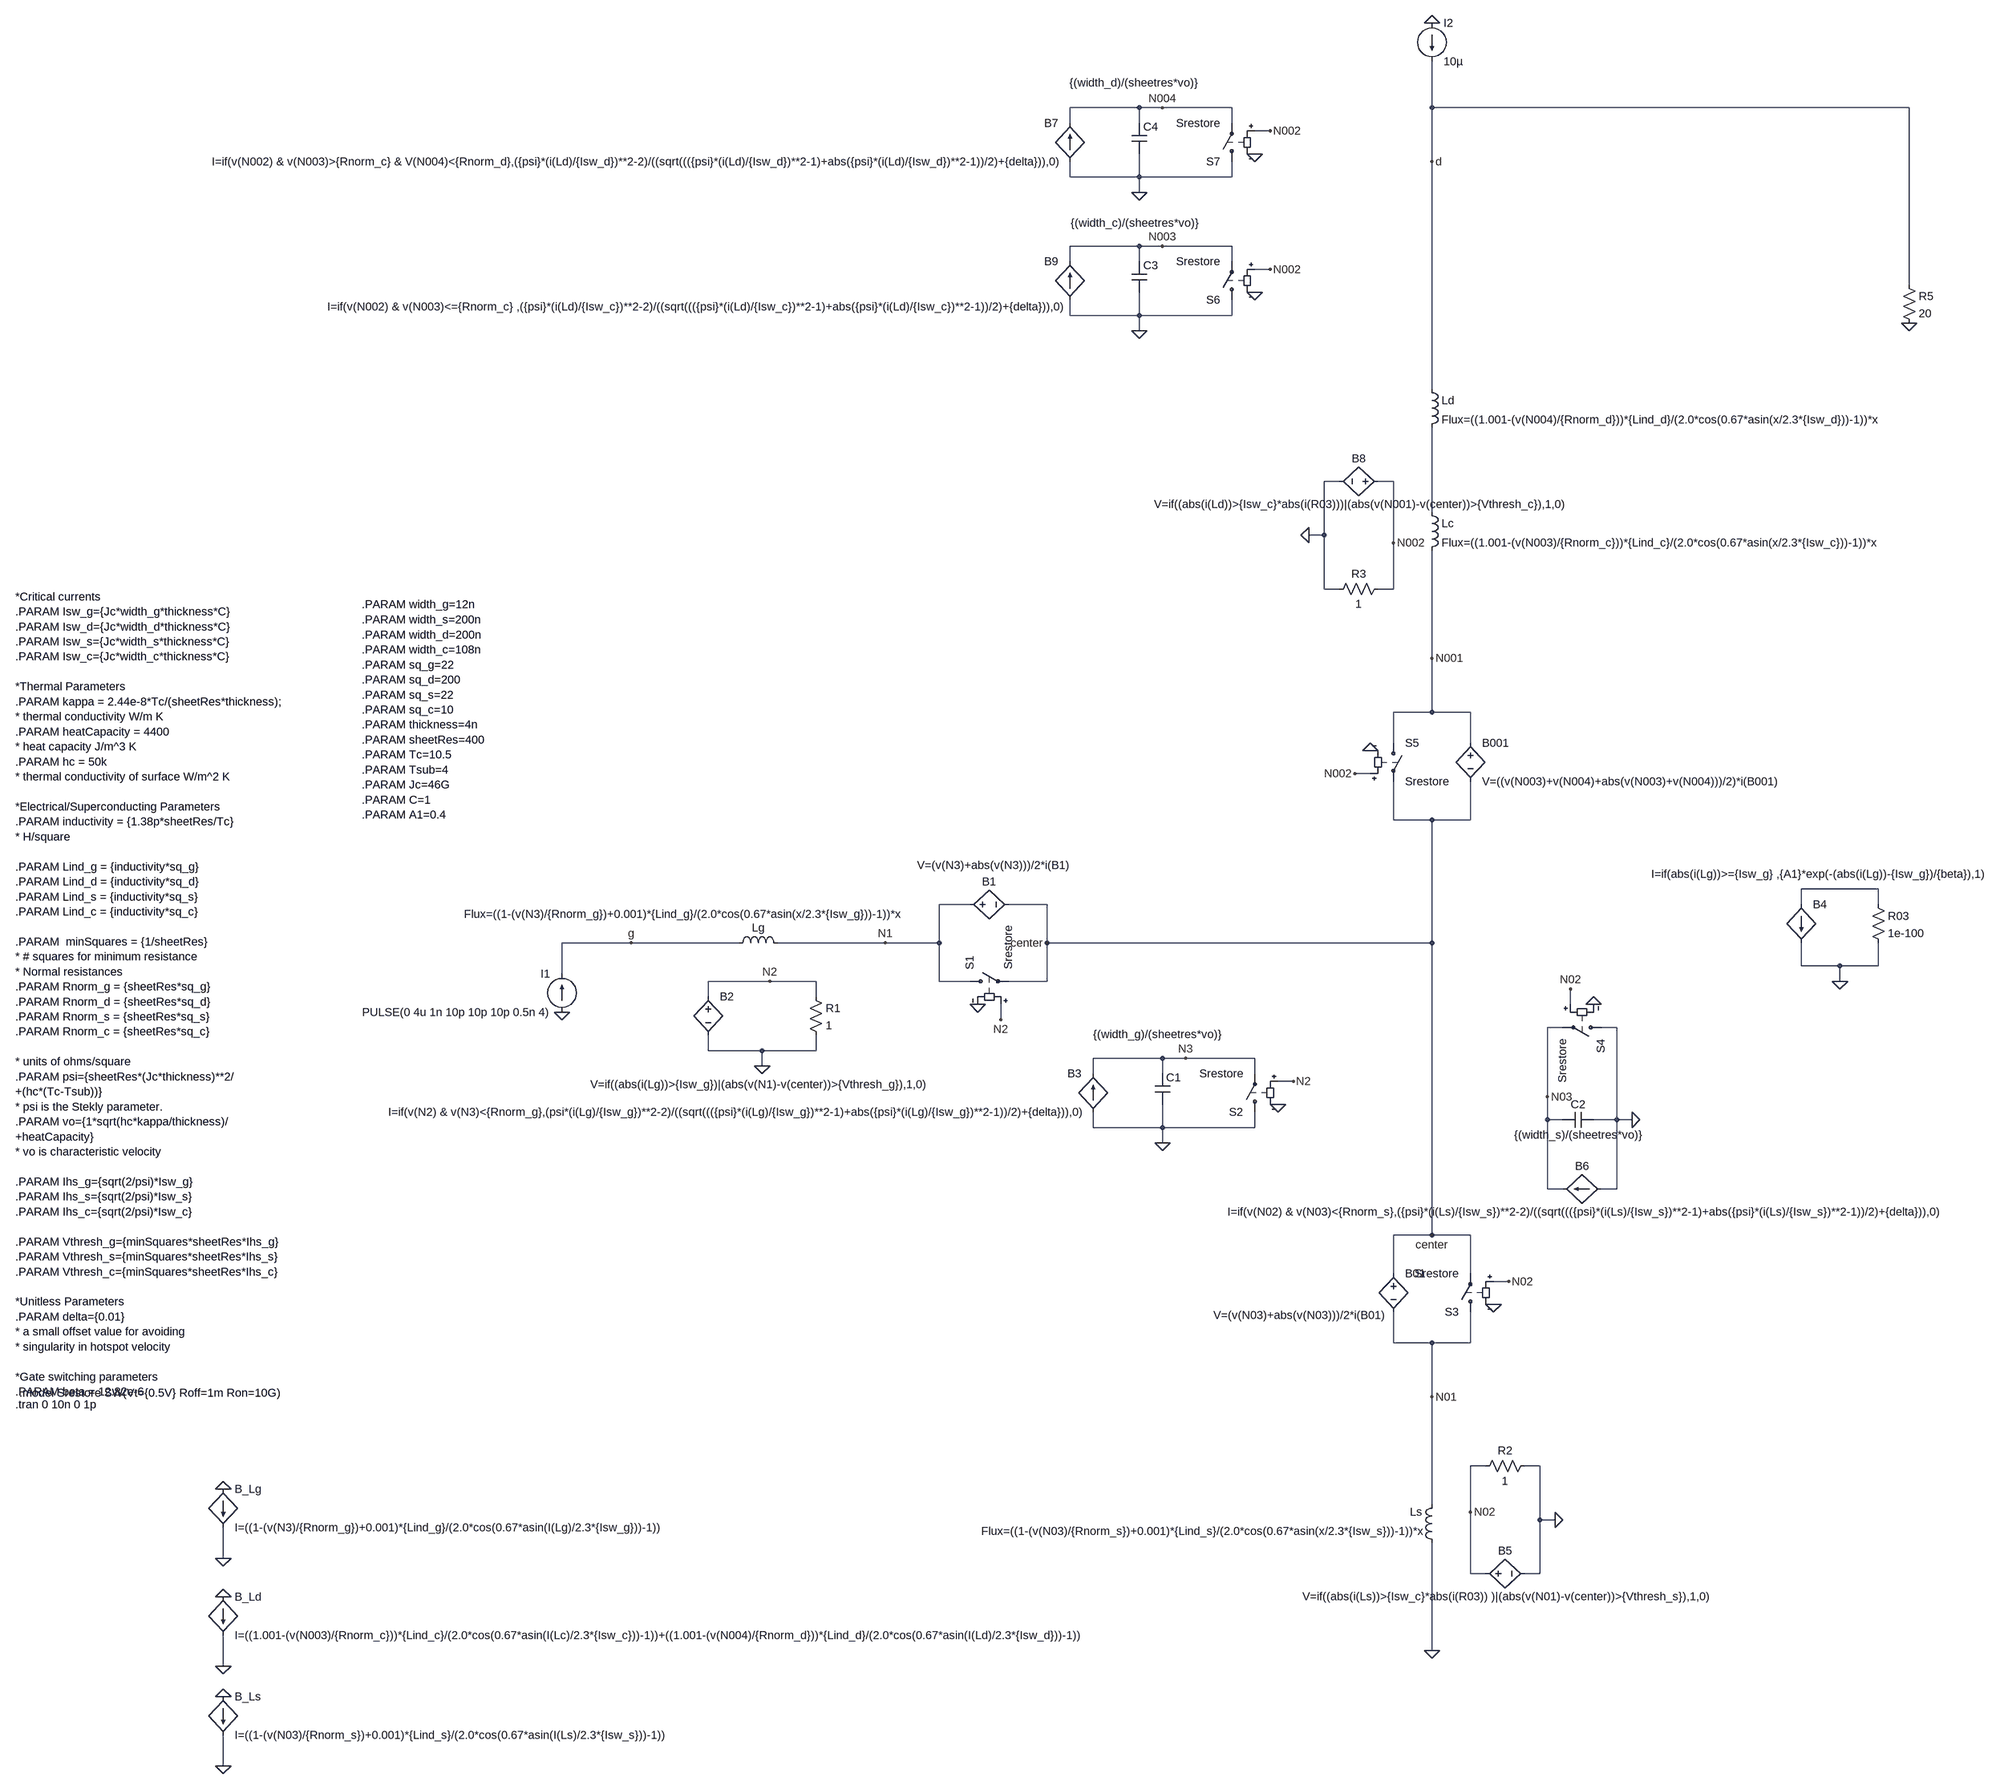
[diagram p0: schematic ntron_model_debug_test.asc]
ntron_model_debug_test.asc, the LTspice schematic file:
Version 4
SHEET 1 4648 1460
WIRE 1712 -2144 1568 -2144
WIRE 1760 -2144 1712 -2144
WIRE 1904 -2144 1760 -2144
WIRE 2320 -2144 2320 -2240
WIRE 3312 -2144 2320 -2144
WIRE 1568 -2112 1568 -2144
WIRE 1712 -2112 1712 -2144
WIRE 1904 -2112 1904 -2144
WIRE 1984 -2096 1952 -2096
WIRE 2320 -2032 2320 -2144
WIRE 1568 -2000 1568 -2032
WIRE 1712 -2000 1712 -2048
WIRE 1712 -2000 1568 -2000
WIRE 1904 -2000 1904 -2032
WIRE 1904 -2000 1712 -2000
WIRE 1712 -1968 1712 -2000
WIRE 1712 -1856 1568 -1856
WIRE 1760 -1856 1712 -1856
WIRE 1904 -1856 1760 -1856
WIRE 1568 -1824 1568 -1856
WIRE 1712 -1824 1712 -1856
WIRE 1904 -1824 1904 -1856
WIRE 1984 -1808 1952 -1808
WIRE 3312 -1776 3312 -2144
WIRE 1568 -1712 1568 -1744
WIRE 1712 -1712 1712 -1760
WIRE 1712 -1712 1568 -1712
WIRE 1904 -1712 1904 -1744
WIRE 1904 -1712 1712 -1712
WIRE 1712 -1680 1712 -1712
WIRE 2320 -1424 2320 -2032
WIRE 2128 -1232 2096 -1232
WIRE 2240 -1232 2208 -1232
WIRE 2320 -1168 2320 -1344
WIRE 2096 -1120 2096 -1232
WIRE 2096 -1120 2064 -1120
WIRE 2240 -1104 2240 -1232
WIRE 2096 -1008 2096 -1120
WIRE 2128 -1008 2096 -1008
WIRE 2240 -1008 2240 -1104
WIRE 2240 -1008 2208 -1008
WIRE 2320 -864 2320 -1088
WIRE 2320 -752 2320 -864
WIRE 2320 -752 2240 -752
WIRE 2400 -752 2320 -752
WIRE 2240 -688 2240 -752
WIRE 2400 -688 2400 -752
WIRE 2192 -624 2160 -624
WIRE 2240 -528 2240 -608
WIRE 2320 -528 2240 -528
WIRE 2400 -528 2400 -608
WIRE 2400 -528 2320 -528
WIRE 3248 -384 3088 -384
WIRE 1360 -352 1296 -352
WIRE 1520 -352 1440 -352
WIRE 3088 -352 3088 -384
WIRE 3248 -352 3248 -384
WIRE 656 -272 512 -272
WIRE 880 -272 656 -272
WIRE 1184 -272 960 -272
WIRE 1296 -272 1296 -352
WIRE 1296 -272 1184 -272
WIRE 1520 -272 1520 -352
WIRE 2320 -272 2320 -528
WIRE 2320 -272 1520 -272
WIRE 3088 -224 3088 -272
WIRE 3168 -224 3088 -224
WIRE 3248 -224 3248 -272
WIRE 3248 -224 3168 -224
WIRE 512 -208 512 -272
WIRE 944 -192 816 -192
WIRE 1040 -192 944 -192
WIRE 1296 -192 1296 -272
WIRE 1360 -192 1296 -192
WIRE 1520 -192 1520 -272
WIRE 1520 -192 1440 -192
WIRE 3168 -192 3168 -224
WIRE 816 -160 816 -192
WIRE 1040 -160 1040 -192
WIRE 2608 -144 2608 -176
WIRE 1424 -112 1424 -144
WIRE 2592 -96 2560 -96
WIRE 2704 -96 2672 -96
WIRE 816 -48 816 -80
WIRE 928 -48 816 -48
WIRE 1040 -48 1040 -80
WIRE 1040 -48 928 -48
WIRE 1760 -32 1616 -32
WIRE 1808 -32 1760 -32
WIRE 1952 -32 1808 -32
WIRE 928 -16 928 -48
WIRE 1616 0 1616 -32
WIRE 1760 0 1760 -32
WIRE 1952 0 1952 -32
WIRE 2032 16 2000 16
WIRE 2560 48 2560 -96
WIRE 2560 96 2560 48
WIRE 2592 96 2560 96
WIRE 2704 96 2704 -96
WIRE 2704 96 2656 96
WIRE 2736 96 2704 96
WIRE 1616 112 1616 80
WIRE 1760 112 1760 64
WIRE 1760 112 1616 112
WIRE 1952 112 1952 80
WIRE 1952 112 1760 112
WIRE 1760 144 1760 112
WIRE 2560 240 2560 96
WIRE 2592 240 2560 240
WIRE 2704 240 2704 96
WIRE 2704 240 2672 240
WIRE 2320 336 2320 -272
WIRE 2320 336 2240 336
WIRE 2400 336 2320 336
WIRE 2240 416 2240 336
WIRE 2400 416 2400 336
WIRE 2480 432 2448 432
WIRE 2240 560 2240 496
WIRE 2320 560 2240 560
WIRE 2400 560 2400 496
WIRE 2400 560 2320 560
WIRE 2320 672 2320 560
WIRE 2432 816 2400 816
WIRE 2544 816 2512 816
WIRE 2320 896 2320 672
WIRE 2400 912 2400 816
WIRE 2544 928 2544 816
WIRE 2576 928 2544 928
WIRE -192 1008 -192 944
WIRE 2400 1040 2400 912
WIRE 2432 1040 2400 1040
WIRE 2544 1040 2544 928
WIRE 2544 1040 2512 1040
WIRE 2320 1200 2320 976
WIRE -192 1232 -192 1168
WIRE -192 1440 -192 1376
FLAG 1520 -272 center
FLAG 656 -272 g
FLAG 1184 -272 N1
FLAG 1376 -144 0
FLAG 1424 -112 N2
FLAG 928 -16 0
FLAG 944 -192 N2
FLAG 1760 144 0
FLAG 2000 64 0
FLAG 2032 16 N2
FLAG 1808 -32 N3
FLAG 2320 336 center
FLAG 2320 672 N01
FLAG 2448 480 0
FLAG 2480 432 N02
FLAG 2576 928 0
FLAG 2400 912 N02
FLAG 2736 96 0
FLAG 2656 -144 0
FLAG 2608 -176 N02
FLAG 2560 48 N03
FLAG 3168 -192 0
FLAG 2320 1200 0
FLAG 512 -128 0
FLAG 2320 -864 N001
FLAG 2192 -672 0
FLAG 2160 -624 N002
FLAG 2064 -1120 0
FLAG 2240 -1104 N002
FLAG 1712 -1680 0
FLAG 1952 -1760 0
FLAG 1984 -1808 N002
FLAG 1760 -1856 N003
FLAG 3312 -1696 0
FLAG 2320 -2320 0
FLAG 2320 -2032 d
FLAG 1712 -1968 0
FLAG 1952 -2048 0
FLAG 1984 -2096 N002
FLAG 1760 -2144 N004
FLAG -192 864 0
FLAG -192 1008 0
FLAG -192 1088 0
FLAG -192 1232 0
FLAG -192 1296 0
FLAG -192 1440 0
SYMBOL ind 864 -256 R270
WINDOW 0 32 56 VTop 2
WINDOW 3 60 -102 VTop 2
SYMATTR InstName Lg
SYMATTR Value Flux=((1-(v(N3)/{Rnorm_g})+0.001)*{Lind_g}/(2.0*cos(0.67*asin(x/2.3*{Isw_g}))-1))*x
SYMATTR SpiceLine Rser=1e-100
SYMBOL sw 1344 -192 R270
SYMATTR InstName S1
SYMATTR Value Srestore
SYMATTR Value2 OFF
SYMBOL bv 1344 -352 R270
WINDOW 0 32 56 VTop 2
WINDOW 3 97 64 VBottom 2
SYMATTR InstName B1
SYMATTR Value V=(v(N3)+abs(v(N3)))/2*i(B1)
SYMBOL res 1024 -176 R0
SYMATTR InstName R1
SYMATTR Value 1
SYMBOL bv 816 -176 R0
WINDOW 3 -245 198 Left 2
SYMATTR Value V=if((abs(i(Lg))>{Isw_g})|(abs(v(N1)-v(center))>{Vthresh_g}),1,0)
SYMATTR InstName B2
SYMBOL bi 1616 80 R180
WINDOW 0 24 80 Left 2
WINDOW 3 24 0 Left 2
SYMATTR InstName B3
SYMATTR Value I=if(v(N2) & v(N3)<{Rnorm_g},(psi*(i(Lg)/{Isw_g})**2-2)/((sqrt((({psi}*(i(Lg)/{Isw_g})**2-1)+abs({psi}*(i(Lg)/{Isw_g})**2-1))/2)+{delta})),0)
SYMBOL cap 1744 0 R0
WINDOW 3 -128 -82 Left 2
SYMATTR Value {(width_g)/(sheetres*vo)}
SYMATTR InstName C1
SYMBOL sw 1952 96 R180
SYMATTR InstName S2
SYMATTR Value Srestore
SYMATTR Value2 OFF
SYMBOL ind 2336 992 R180
WINDOW 0 36 80 Left 2
WINDOW 3 36 40 Left 2
SYMATTR InstName Ls
SYMATTR Value Flux=((1-(v(N03)/{Rnorm_s})+0.001)*{Lind_s}/(2.0*cos(0.67*asin(x/2.3*{Isw_s}))-1))*x
SYMATTR SpiceLine Rser=1e-100
SYMBOL sw 2400 512 R180
SYMATTR InstName S3
SYMATTR Value Srestore
SYMATTR Value2 OFF
SYMBOL bv 2240 400 R0
WINDOW 3 -374 102 Left 2
SYMATTR Value V=(v(N03)+abs(v(N03)))/2*i(B01)
SYMATTR InstName B01
SYMBOL res 2416 832 R270
WINDOW 0 32 56 VTop 2
WINDOW 3 0 56 VBottom 2
SYMATTR InstName R2
SYMATTR Value 1
SYMBOL bv 2416 1040 R270
WINDOW 0 32 56 VTop 2
WINDOW 3 -32 56 VBottom 2
SYMATTR InstName B5
SYMATTR Value V=if((abs(i(Ls))>{Isw_c}*abs(i(R03)) )|(abs(v(N01)-v(center))>{Vthresh_s}),1,0)
SYMBOL bi 2672 240 R90
WINDOW 0 -32 40 VBottom 2
WINDOW 3 32 40 VTop 2
SYMATTR InstName B6
SYMATTR Value I=if(v(N02) & v(N03)<{Rnorm_s},({psi}*(i(Ls)/{Isw_s})**2-2)/((sqrt((({psi}*(i(Ls)/{Isw_s})**2-1)+abs({psi}*(i(Ls)/{Isw_s})**2-1))/2)+{delta})),0)
SYMBOL cap 2592 112 R270
WINDOW 0 32 32 VTop 2
WINDOW 3 0 32 VBottom 2
SYMATTR InstName C2
SYMATTR Value {(width_s)/(sheetres*vo)}
SYMBOL sw 2688 -96 R90
SYMATTR InstName S4
SYMATTR Value Srestore
SYMATTR Value2 OFF
SYMBOL res 3232 -368 R0
SYMATTR InstName R03
SYMATTR Value 1e-100
SYMBOL bi 3088 -352 R0
WINDOW 3 -312 -63 Left 2
SYMATTR Value I=if(abs(i(Lg))>={Isw_g} ,{A1}*exp(-(abs(i(Lg))-{Isw_g})/{beta}),1)
SYMATTR InstName B4
SYMBOL current 512 -128 R180
WINDOW 0 24 80 Left 2
WINDOW 3 24 0 Left 2
WINDOW 123 0 0 Left 0
WINDOW 39 0 0 Left 0
SYMATTR InstName I1
SYMATTR Value PULSE(0 4u 1n 10p 10p 10p 0.5n 4)
SYMBOL ind 2304 -1184 R0
SYMATTR InstName Lc
SYMATTR Value Flux=((1.001-(v(N003)/{Rnorm_c}))*{Lind_c}/(2.0*cos(0.67*asin(x/2.3*{Isw_c}))-1))*x
SYMATTR SpiceLine Rser=1e-100
SYMBOL sw 2240 -704 R0
SYMATTR InstName S5
SYMATTR Value Srestore
SYMATTR Value2 OFF
SYMBOL bv 2400 -704 R0
SYMATTR InstName B001
SYMATTR Value V=((v(N003)+v(N004)+abs(v(N003)+v(N004)))/2)*i(B001)
SYMBOL res 2224 -1024 R90
WINDOW 0 0 56 VBottom 2
WINDOW 3 32 56 VTop 2
SYMATTR InstName R3
SYMATTR Value 1
SYMBOL bv 2224 -1232 R90
WINDOW 0 -32 56 VBottom 2
WINDOW 3 32 56 VTop 2
SYMATTR InstName B8
SYMATTR Value V=if((abs(i(Ld))>{Isw_c}*abs(i(R03)))|(abs(v(N001)-v(center))>{Vthresh_c}),1,0)
SYMBOL bi 1568 -1744 R180
WINDOW 0 24 80 Left 2
WINDOW 3 17 -14 Left 2
SYMATTR InstName B9
SYMATTR Value I=if(v(N002) & v(N003)<={Rnorm_c} ,({psi}*(i(Ld)/{Isw_c})**2-2)/((sqrt((({psi}*(i(Ld)/{Isw_c})**2-1)+abs({psi}*(i(Ld)/{Isw_c})**2-1))/2)+{delta})),0)
SYMBOL cap 1696 -1824 R0
WINDOW 3 -127 -80 Left 2
SYMATTR Value {(width_c)/(sheetres*vo)}
SYMATTR InstName C3
SYMBOL sw 1904 -1728 R180
SYMATTR InstName S6
SYMATTR Value Srestore
SYMATTR Value2 OFF
SYMBOL current 2320 -2320 R0
WINDOW 123 0 0 Left 0
WINDOW 39 0 0 Left 0
SYMATTR InstName I2
SYMATTR Value 10µ
SYMBOL res 3296 -1792 R0
SYMATTR InstName R5
SYMATTR Value 20
SYMBOL ind 2304 -1440 R0
SYMATTR InstName Ld
SYMATTR Value Flux=((1.001-(v(N004)/{Rnorm_d}))*{Lind_d}/(2.0*cos(0.67*asin(x/2.3*{Isw_d}))-1))*x
SYMATTR SpiceLine Rser=1e-100
SYMBOL bi 1568 -2032 R180
WINDOW 0 24 80 Left 2
WINDOW 3 24 0 Left 2
SYMATTR InstName B7
SYMATTR Value I=if(v(N002) & v(N003)>{Rnorm_c} & V(N004)<{Rnorm_d},({psi}*(i(Ld)/{Isw_d})**2-2)/((sqrt((({psi}*(i(Ld)/{Isw_d})**2-1)+abs({psi}*(i(Ld)/{Isw_d})**2-1))/2)+{delta})),0)
SYMBOL cap 1696 -2112 R0
WINDOW 3 -129 -84 Left 2
SYMATTR Value {(width_d)/(sheetres*vo)}
SYMATTR InstName C4
SYMBOL sw 1904 -2016 R180
SYMATTR InstName S7
SYMATTR Value Srestore
SYMATTR Value2 OFF
SYMBOL bi -192 864 R0
SYMATTR InstName B_Lg
SYMATTR Value I=((1-(v(N3)/{Rnorm_g})+0.001)*{Lind_g}/(2.0*cos(0.67*asin(I(Lg)/2.3*{Isw_g}))-1))
SYMBOL bi -192 1088 R0
SYMATTR InstName B_Ld
SYMATTR Value I=((1.001-(v(N003)/{Rnorm_c}))*{Lind_c}/(2.0*cos(0.67*asin(I(Lc)/2.3*{Isw_c}))-1))+((1.001-(v(N004)/{Rnorm_d}))*{Lind_d}/(2.0*cos(0.67*asin(I(Ld)/2.3*{Isw_d}))-1))
SYMBOL bi -192 1296 R0
SYMATTR InstName B_Ls
SYMATTR Value I=((1-(v(N03)/{Rnorm_s})+0.001)*{Lind_s}/(2.0*cos(0.67*asin(I(Ls)/2.3*{Isw_s}))-1))
TEXT -624 -992 Left 2 !*Critical currents\n.PARAM Isw_g={Jc*width_g*thickness*C}\n.PARAM Isw_d={Jc*width_d*thickness*C}\n.PARAM Isw_s={Jc*width_s*thickness*C}\n.PARAM Isw_c={Jc*width_c*thickness*C}\n \n*Thermal Parameters\n.PARAM kappa = 2.44e-8*Tc/(sheetRes*thickness);\n* thermal conductivity W/m K\n.PARAM heatCapacity = 4400\n* heat capacity J/m^3 K\n.PARAM hc = 50k\n* thermal conductivity of surface W/m^2 K\n \n*Electrical/Superconducting Parameters\n.PARAM inductivity = {1.38p*sheetRes/Tc}\n* H/square\n \n.PARAM Lind_g = {inductivity*sq_g}\n.PARAM Lind_d = {inductivity*sq_d}\n.PARAM Lind_s = {inductivity*sq_s}\n.PARAM Lind_c = {inductivity*sq_c}\n \n.PARAM  minSquares = {1/sheetRes}\n* # squares for minimum resistance\n* Normal resistances\n.PARAM Rnorm_g = {sheetRes*sq_g}\n.PARAM Rnorm_d = {sheetRes*sq_d}\n.PARAM Rnorm_s = {sheetRes*sq_s}\n.PARAM Rnorm_c = {sheetRes*sq_c}\n \n* units of ohms/square\n.PARAM psi={sheetRes*(Jc*thickness)**2/\n+(hc*(Tc-Tsub))}\n* psi is the Stekly parameter.\n.PARAM vo={1*sqrt(hc*kappa/thickness)/\n+heatCapacity}\n* vo is characteristic velocity\n \n.PARAM Ihs_g={sqrt(2/psi)*Isw_g}\n.PARAM Ihs_s={sqrt(2/psi)*Isw_s}\n.PARAM Ihs_c={sqrt(2/psi)*Isw_c}\n \n.PARAM Vthresh_g={minSquares*sheetRes*Ihs_g}\n.PARAM Vthresh_s={minSquares*sheetRes*Ihs_s}\n.PARAM Vthresh_c={minSquares*sheetRes*Ihs_c}\n \n*Unitless Parameters\n.PARAM delta={0.01}\n* a small offset value for avoiding\n* singularity in hotspot velocity\n \n*Gate switching parameters\n.PARAM beta = 12.82e-6
TEXT 96 -944 Left 2 !.PARAM width_s=200n\n.PARAM width_d=200n\n.PARAM width_c=108n\n.PARAM sq_g=22\n.PARAM sq_d=200\n.PARAM sq_s=22\n.PARAM sq_c=10\n.PARAM thickness=4n\n.PARAM sheetRes=400\n.PARAM Tc=10.5\n.PARAM Tsub=4\n.PARAM Jc=46G\n.PARAM C=1\n.PARAM A1=0.4
TEXT -616 664 Left 2 !.model Srestore SW(Vt={0.5V} Roff=1m Ron=10G)
TEXT -624 688 Left 2 !.tran 0 10n 0 1p
TEXT 96 -976 Left 2 !.PARAM width_g=12n

The netlist it stands for:
* ntron_model_debug_test.asc
Lg g N1 Flux=((1-(v(N3)/{Rnorm_g})+0.001)*{Lind_g}/(2.0*cos(0.67*asin(x/2.3*{Isw_g}))-1))*x Rser=1e-100
S1 N1 center N2 0 Srestore OFF
B1 N1 center V=(v(N3)+abs(v(N3)))/2*i(B1)
R1 N2 0 1
B2 N2 0 V=if((abs(i(Lg))>{Isw_g})|(abs(v(N1)-v(center))>{Vthresh_g}),1,0)
B3 0 N3 I=if(v(N2) & v(N3)<{Rnorm_g},(psi*(i(Lg)/{Isw_g})**2-2)/((sqrt((({psi}*(i(Lg)/{Isw_g})**2-1)+abs({psi}*(i(Lg)/{Isw_g})**2-1))/2)+{delta})),0)
C1 N3 0 {(width_g)/(sheetres*vo)}
S2 0 N3 N2 0 Srestore OFF
Ls 0 N01 Flux=((1-(v(N03)/{Rnorm_s})+0.001)*{Lind_s}/(2.0*cos(0.67*asin(x/2.3*{Isw_s}))-1))*x Rser=1e-100
S3 N01 center N02 0 Srestore OFF
B01 center N01 V=(v(N03)+abs(v(N03)))/2*i(B01)
R2 N02 0 1
B5 N02 0 V=if((abs(i(Ls))>{Isw_c}*abs(i(R03)) )|(abs(v(N01)-v(center))>{Vthresh_s}),1,0)
B6 0 N03 I=if(v(N02) & v(N03)<{Rnorm_s},({psi}*(i(Ls)/{Isw_s})**2-2)/((sqrt((({psi}*(i(Ls)/{Isw_s})**2-1)+abs({psi}*(i(Ls)/{Isw_s})**2-1))/2)+{delta})),0)
C2 N03 0 {(width_s)/(sheetres*vo)}
S4 0 N03 N02 0 Srestore OFF
R03 N006 0 1e-100
B4 N006 0 I=if(abs(i(Lg))>={Isw_g} ,{A1}*exp(-(abs(i(Lg))-{Isw_g})/{beta}),1)
I1 0 g PULSE(0 4u 1n 10p 10p 10p 0.5n 4)
Lc N005 N001 Flux=((1.001-(v(N003)/{Rnorm_c}))*{Lind_c}/(2.0*cos(0.67*asin(x/2.3*{Isw_c}))-1))*x Rser=1e-100
S5 N001 center N002 0 Srestore OFF
B001 N001 center V=((v(N003)+v(N004)+abs(v(N003)+v(N004)))/2)*i(B001)
R3 N002 0 1
B8 N002 0 V=if((abs(i(Ld))>{Isw_c}*abs(i(R03)))|(abs(v(N001)-v(center))>{Vthresh_c}),1,0)
B9 0 N003 I=if(v(N002) & v(N003)<={Rnorm_c} ,({psi}*(i(Ld)/{Isw_c})**2-2)/((sqrt((({psi}*(i(Ld)/{Isw_c})**2-1)+abs({psi}*(i(Ld)/{Isw_c})**2-1))/2)+{delta})),0)
C3 N003 0 {(width_c)/(sheetres*vo)}
S6 0 N003 N002 0 Srestore OFF
I2 0 d 10µ
R5 d 0 20
Ld d N005 Flux=((1.001-(v(N004)/{Rnorm_d}))*{Lind_d}/(2.0*cos(0.67*asin(x/2.3*{Isw_d}))-1))*x Rser=1e-100
B7 0 N004 I=if(v(N002) & v(N003)>{Rnorm_c} & V(N004)<{Rnorm_d},({psi}*(i(Ld)/{Isw_d})**2-2)/((sqrt((({psi}*(i(Ld)/{Isw_d})**2-1)+abs({psi}*(i(Ld)/{Isw_d})**2-1))/2)+{delta})),0)
C4 N004 0 {(width_d)/(sheetres*vo)}
S7 0 N004 N002 0 Srestore OFF
B_Lg 0 0 I=((1-(v(N3)/{Rnorm_g})+0.001)*{Lind_g}/(2.0*cos(0.67*asin(I(Lg)/2.3*{Isw_g}))-1))
B_Ld 0 0 I=((1.001-(v(N003)/{Rnorm_c}))*{Lind_c}/(2.0*cos(0.67*asin(I(Lc)/2.3*{Isw_c}))-1))+((1.001-(v(N004)/{Rnorm_d}))*{Lind_d}/(2.0*cos(0.67*asin(I(Ld)/2.3*{Isw_d}))-1))
B_Ls 0 0 I=((1-(v(N03)/{Rnorm_s})+0.001)*{Lind_s}/(2.0*cos(0.67*asin(I(Ls)/2.3*{Isw_s}))-1))
*Critical currents
.PARAM Isw_g={Jc*width_g*thickness*C}
.PARAM Isw_d={Jc*width_d*thickness*C}
.PARAM Isw_s={Jc*width_s*thickness*C}
.PARAM Isw_c={Jc*width_c*thickness*C}
*Thermal Parameters
.PARAM kappa = 2.44e-8*Tc/(sheetRes*thickness);
* thermal conductivity W/m K
.PARAM heatCapacity = 4400
* heat capacity J/m^3 K
.PARAM hc = 50k
* thermal conductivity of surface W/m^2 K
*Electrical/Superconducting Parameters
.PARAM inductivity = {1.38p*sheetRes/Tc}
* H/square
.PARAM Lind_g = {inductivity*sq_g}
.PARAM Lind_d = {inductivity*sq_d}
.PARAM Lind_s = {inductivity*sq_s}
.PARAM Lind_c = {inductivity*sq_c}
.PARAM  minSquares = {1/sheetRes}
* # squares for minimum resistance
* Normal resistances
.PARAM Rnorm_g = {sheetRes*sq_g}
.PARAM Rnorm_d = {sheetRes*sq_d}
.PARAM Rnorm_s = {sheetRes*sq_s}
.PARAM Rnorm_c = {sheetRes*sq_c}
* units of ohms/square
.PARAM psi={sheetRes*(Jc*thickness)**2/
+(hc*(Tc-Tsub))}
* psi is the Stekly parameter.
.PARAM vo={1*sqrt(hc*kappa/thickness)/
+heatCapacity}
* vo is characteristic velocity
.PARAM Ihs_g={sqrt(2/psi)*Isw_g}
.PARAM Ihs_s={sqrt(2/psi)*Isw_s}
.PARAM Ihs_c={sqrt(2/psi)*Isw_c}
.PARAM Vthresh_g={minSquares*sheetRes*Ihs_g}
.PARAM Vthresh_s={minSquares*sheetRes*Ihs_s}
.PARAM Vthresh_c={minSquares*sheetRes*Ihs_c}
*Unitless Parameters
.PARAM delta={0.01}
* a small offset value for avoiding
* singularity in hotspot velocity
*Gate switching parameters
.PARAM beta = 12.82e-6
.PARAM width_s=200n
.PARAM width_d=200n
.PARAM width_c=108n
.PARAM sq_g=22
.PARAM sq_d=200
.PARAM sq_s=22
.PARAM sq_c=10
.PARAM thickness=4n
.PARAM sheetRes=400
.PARAM Tc=10.5
.PARAM Tsub=4
.PARAM Jc=46G
.PARAM C=1
.PARAM A1=0.4
.model Srestore SW(Vt={0.5V} Roff=1m Ron=10G)
.tran 0 10n 0 1p
.PARAM width_g=12n
.backanno
.end